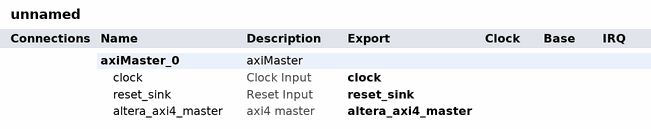
[diagram p0: system contents]
# Platform Designer (Qsys) system unnamed, Cyclone V 5CGXFC7C7F23C8
# Parameters at their usual value, and those the tool derives, are not listed.
package require qsys
create_system unnamed
set_project_property DEVICE_FAMILY {Cyclone V}
set_project_property DEVICE 5CGXFC7C7F23C8

add_instance axiMaster_0 axiMaster 1.0
set_instance_property axiMaster_0 AUTO_EXPORT true

# exported interfaces
add_interface altera_axi4_master axi4 master
set_interface_property altera_axi4_master EXPORT_OF axiMaster_0.altera_axi4_master
add_interface clock clock sink
set_interface_property clock EXPORT_OF axiMaster_0.clock
add_interface reset_sink reset sink
set_interface_property reset_sink EXPORT_OF axiMaster_0.reset_sink

set_interconnect_requirement {$system} qsys_mm.clockCrossingAdapter HANDSHAKE
set_interconnect_requirement {$system} qsys_mm.enableEccProtection FALSE
set_interconnect_requirement {$system} qsys_mm.insertDefaultSlave FALSE
set_interconnect_requirement {$system} qsys_mm.maxAdditionalLatency 1

save_system unnamed.qsys
